# Altium schematic sheet Sheet1.SchDoc
size A; PageSetup: Record=PageOptions|CenterHorizontal=True|CenterVertical=True|PrintScale=1.00|XCorrection=1.00|YCorrection=1.00|PrintKind=2|BorderSize=5000000|LeftOffset=0|BottomOffset=0|Orientation=1|PaperLength=1000|PaperWidth=1000|Scale=100|PaperSource=7|PrintQuality=-3|MediaType=1|DitherType=10|PrintScaleMode=0|PaperKind=Letter|PaperIndex=1
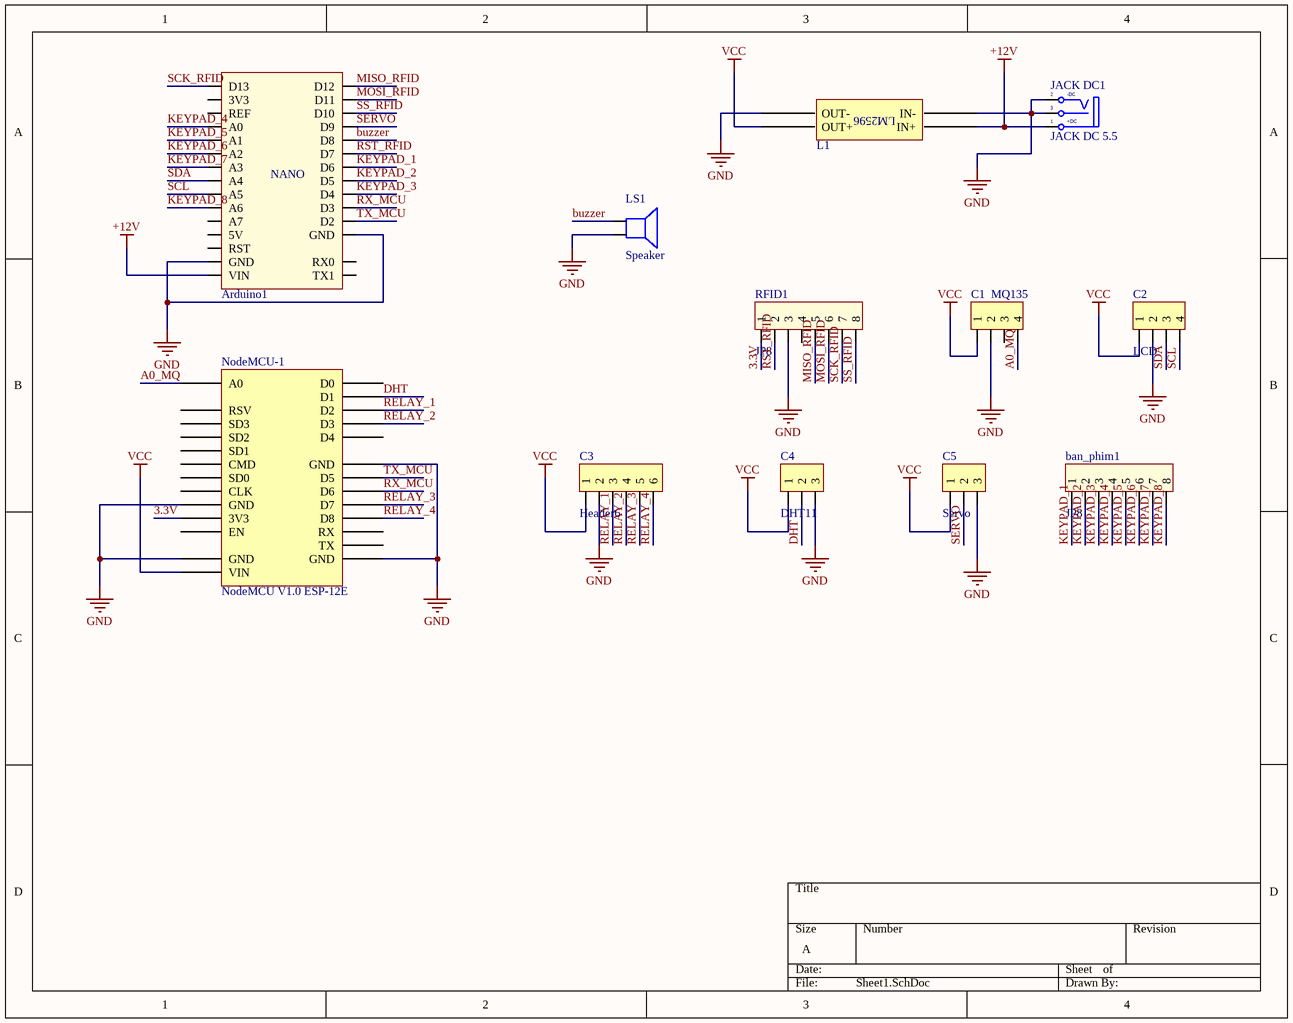
[diagram p0: Sheet1.SchDoc]

## Parts
Arduino1  Arduino Nano  [Arduino Nano]  (value not drawn)
ban_phim1  JP8  [Header8]
C1  MQ135  [HDR4]
C2  LCD  [HDR4]
C3  Header6  [HDR6]
C4  DHT11  [HDR3]
C5  Servo  [HDR3]
JACK_DC1  JACK DC 5.5  [JACK DC 5.5]
L1  BUCK_LM2596  [BUCK_LM2596]  (value not drawn)
LS1  Speaker  [SPEAKER]
NodeMCU-1  NodeMCU V1.0 ESP-12E  [NodeMCU V1.0 ESP-12E]
RFID1  JP8  [Header8]

## Nets
+12V: Arduino1.VIN JACK_DC1.1(T) L1.1(IN+)
GND: Arduino1.GND C1.2 C2.2 C3.2 C4.3 C5.3 JACK_DC1.2(TN) JACK_DC1.3(S) L1.2(IN-) L1.3(OUT-) LS1.2 NodeMCU-1.GND RFID1.3
VCC: C1.1 C2.1 C3.1 C4.1 C5.1 L1.4(OUT+) NodeMCU-1.VIN
3.3V: NodeMCU-1.3V3 RFID1.1
A0_MQ: C1.4 NodeMCU-1.A0
buzzer: Arduino1.D8 LS1.1
DHT: C4.2 NodeMCU-1.D1
KEYPAD_1: Arduino1.D6 ban_phim1.1
KEYPAD_2: Arduino1.D5 ban_phim1.2
KEYPAD_3: Arduino1.D4 ban_phim1.3
KEYPAD_4: Arduino1.A0 ban_phim1.4
KEYPAD_5: Arduino1.A1 ban_phim1.5
KEYPAD_6: Arduino1.A2 ban_phim1.6
KEYPAD_7: Arduino1.A3 ban_phim1.7
KEYPAD_8: Arduino1.A6 ban_phim1.8
MISO_RFID: Arduino1.D12 RFID1.5
MOSI_RFID: Arduino1.D11 RFID1.6
RELAY_1: C3.3 NodeMCU-1.D2
RELAY_2: C3.4 NodeMCU-1.D3
RELAY_3: C3.5 NodeMCU-1.D7
RELAY_4: C3.6 NodeMCU-1.D8
RST_RFID: Arduino1.D7 RFID1.2
RX_MCU: Arduino1.D3 NodeMCU-1.D6
SCK_RFID: Arduino1.D13 RFID1.7
SCL: Arduino1.A5 C2.4
SDA: Arduino1.A4 C2.3
SERVO: Arduino1.D9 C5.2
SS_RFID: Arduino1.D10 RFID1.8
TX_MCU: Arduino1.D2 NodeMCU-1.D5

Not connected (* = marked no-connect by the designer): Arduino1 3V3 5V A7 REF RST RX0 TX1; C1 3; NodeMCU-1 CLK CMD D0 D4 EN RST RSV RX SD0 SD1 SD2 SD3 TX; RFID1 4

## Notes on the sheet
- (in symbol Arduino Nano) NANO
- (in symbol BUCK_LM2596) LM2596
- (in symbol JACK DC 5.5) -DC; +DC

## Library data of the parts
Arduino1 = Arduino Nano: Value: Cau 1A
ban_phim1 RFID1 = Header8: Connector 8; Value: Connector 8
C1 C2 = Header4: Header IDC, 4 x 1 Pin Vertical 2.54mm Pitch (Non-Boxed, Male); Manufacturer: W¨¹rth Elektronik eiSos GmbH; partNo: 613002143121; ComponentLink1 Description: Manufacturer; ComponentLink2 Description: Datasheet; NoPins: 02; Created Date: 29 March 2013; ComponentLink1URL: http://www.we-online.com; ComponentLink2URL: http://katalog.we-online.de/em/datasheet/6130xx143121.pdf; Created by: Karrer Zheng
C3 = Header6: Header IDC, 6 x 1 Pin Vertical 2.54mm Pitch (Non-Boxed, Male); Manufacturer: W¨¹rth Elektronik eiSos GmbH; partNo: 613002143121; ComponentLink1 Description: Manufacturer; ComponentLink2 Description: Datasheet; NoPins: 02; Created Date: 29 March 2013; ComponentLink1URL: http://www.we-online.com; ComponentLink2URL: http://katalog.we-online.de/em/datasheet/6130xx143121.pdf; Created by: Karrer Zheng
C4 C5 = Header3: Header IDC, 3 x 1 Pin Vertical 2.54mm Pitch (Non-Boxed, Male); Manufacturer: W¨¹rth Elektronik eiSos GmbH; partNo: 613002143121; ComponentLink1 Description: Manufacturer; ComponentLink2 Description: Datasheet; NoPins: 02; Created Date: 29 March 2013; ComponentLink1URL: http://www.we-online.com; ComponentLink2URL: http://katalog.we-online.de/em/datasheet/6130xx143121.pdf; Created by: Karrer Zheng
JACK_DC1 = JACK DC 5.5: Value: Jac DC
LS1 = Speaker: Loudspeaker; Published: 24-Mar-1999; LatestRevisionDate: 17-Jul-2002; LatestRevisionNote: Re-released for DXP Platform.; PackageReference: PIN2; Publisher: Altium Limited
NodeMCU-1 = NodeMCU V1.0 ESP-12E: NodeMCU V1.0 ESP8266 (ESP-12E)